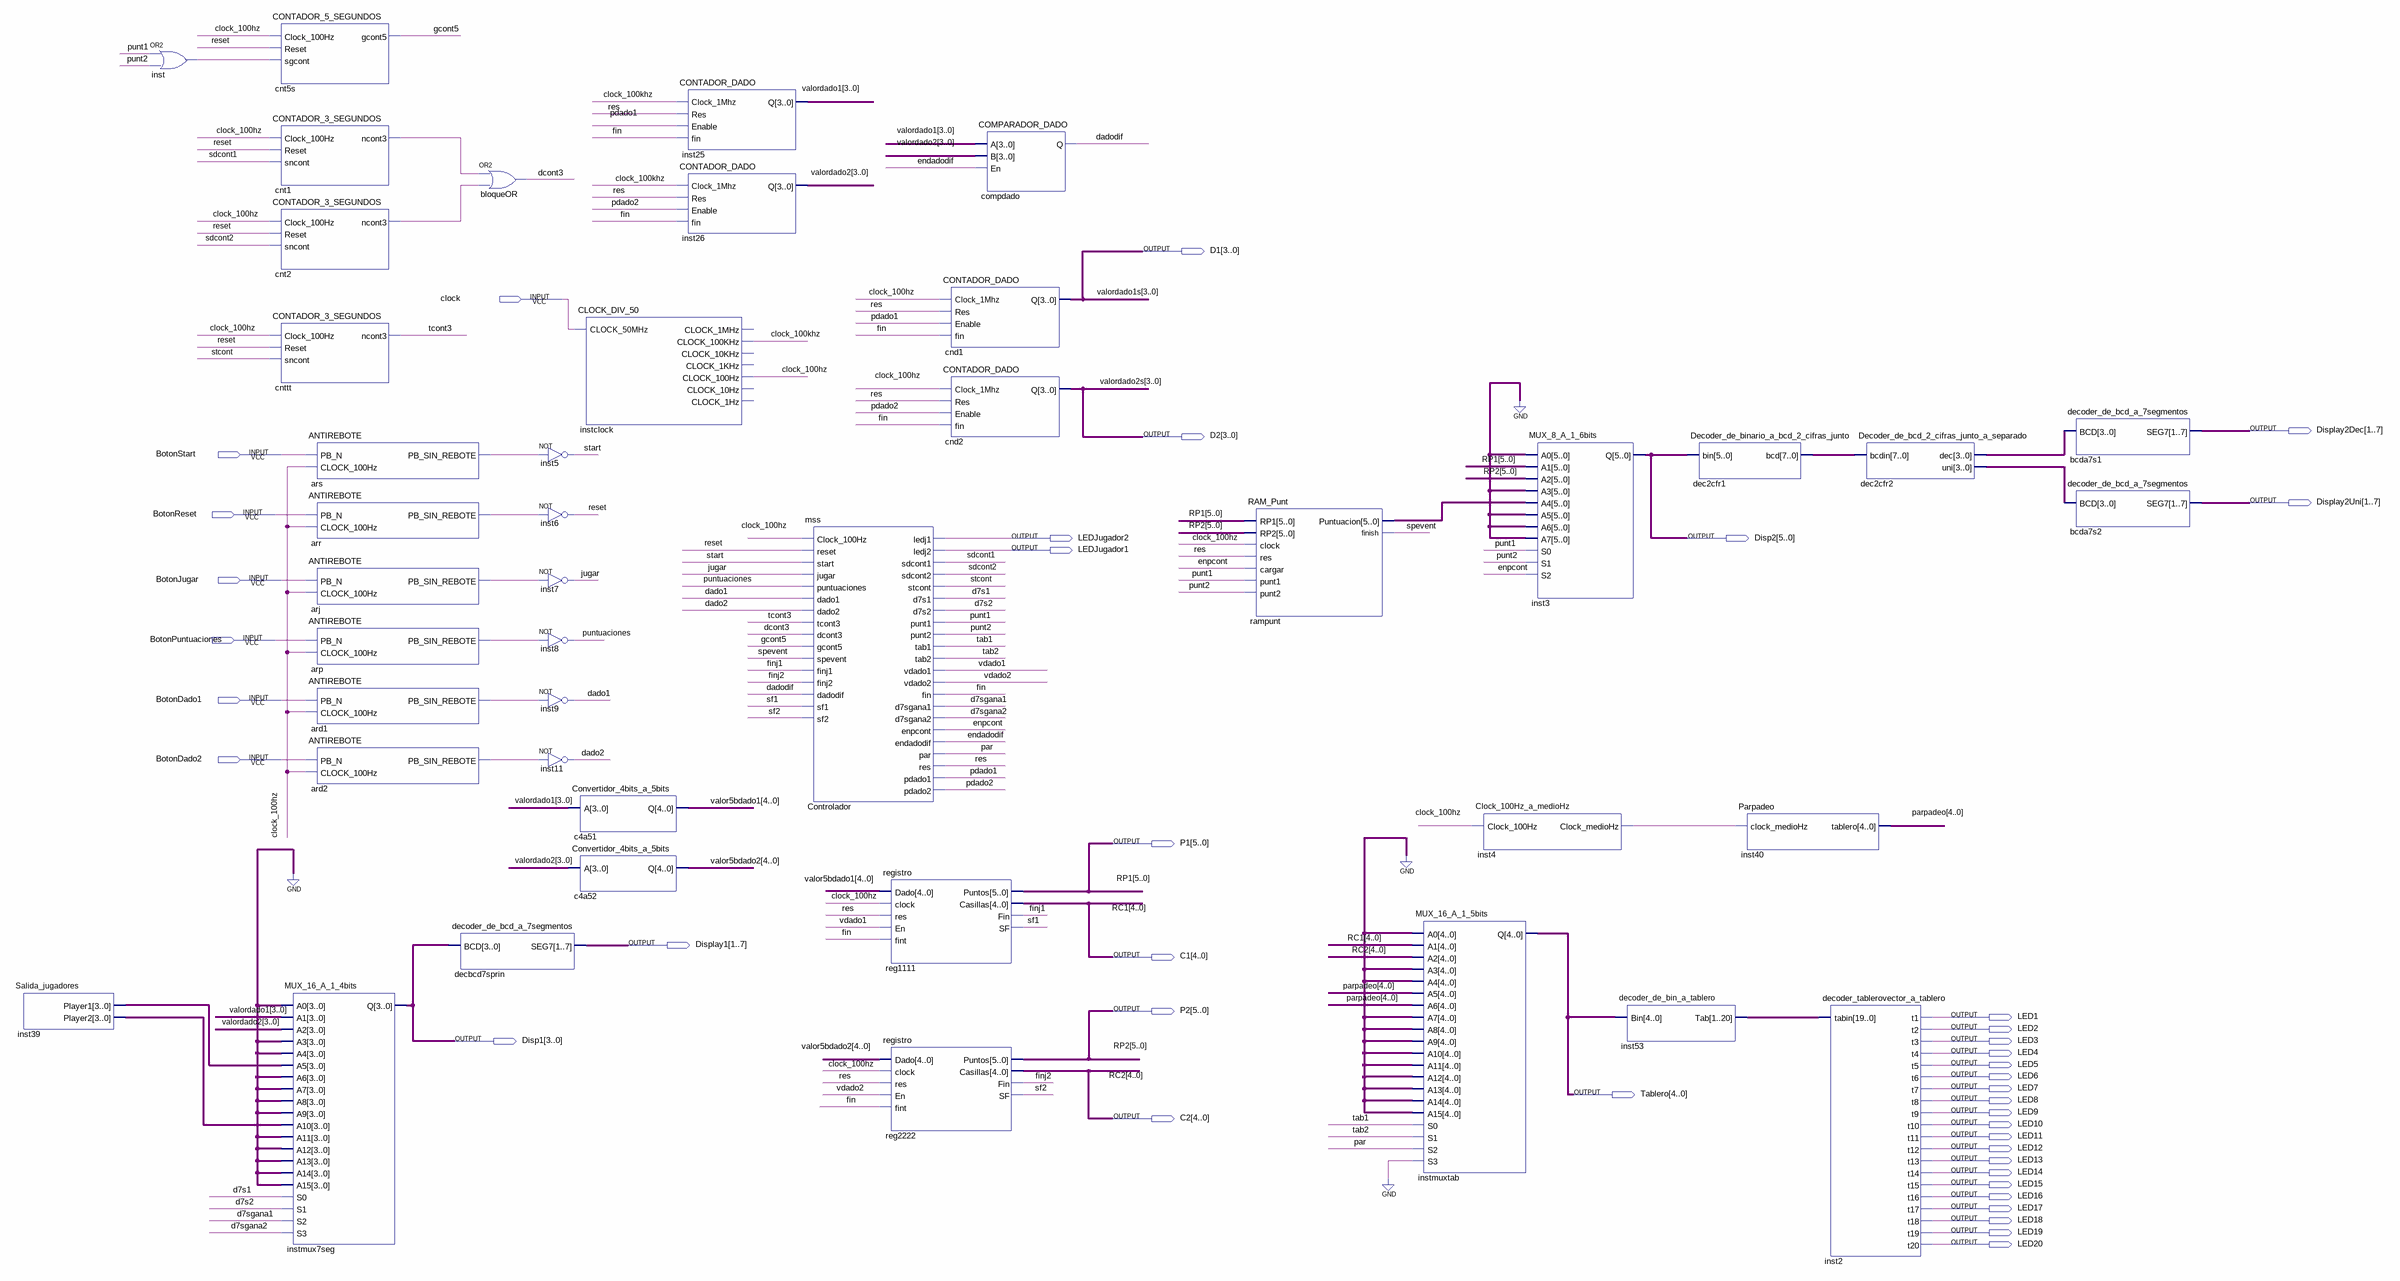
[diagram p0: schematic sheet]
// Quartus schematic ProyectoSD2.bdf as structural Verilog: 43 symbols, 41 pins
module ProyectoSD2 (
  input  clock,
  input  BotonStart,
  input  BotonReset,
  input  BotonJugar,
  input  BotonPuntuaciones,
  input  BotonDado1,
  input  BotonDado2,
  output [3:0] D1,
  output [1:7] Display2Dec,
  output [3:0] D2,
  output [1:7] Display2Uni,
  output LEDJugador2,
  output [5:0] Disp2,
  output LEDJugador1,
  output [5:0] P1,
  output [1:7] Display1,
  output [4:0] C1,
  output [5:0] P2,
  output LED1,
  output LED2,
  output [3:0] Disp1,
  output LED3,
  output LED4,
  output LED5,
  output LED6,
  output LED7,
  output [4:0] Tablero,
  output LED8,
  output LED9,
  output [4:0] C2,
  output LED10,
  output LED11,
  output LED12,
  output LED13,
  output LED14,
  output LED15,
  output LED16,
  output LED17,
  output LED18,
  output LED19,
  output LED20
);

  wire ard1_pb_sin_rebote, ard2_pb_sin_rebote, arj_pb_sin_rebote, arp_pb_sin_rebote, arr_pb_sin_rebote,
       ars_pb_sin_rebote, clock_100hz, clock_100khz, cnt1_ncont3, cnt2_ncont3, d7s1, d7s2, d7sgana1,
       d7sgana2, dado1, dado2, dadodif, dcont3, endadodif, enpcont, fin, finj1, finj2, gcont5,
       inst4_clock_mediohz, inst_out, jugar, par, pdado1, pdado2, punt1, punt2, puntuaciones, res, reset,
       sdcont1, sdcont2, sf1, sf2, spevent, start, stcont, tab1, tab2, tcont3, vdado1, vdado2;
  wire [3:0] dec2cfr2_dec, dec2cfr2_uni, inst39_player1, inst39_player2, valordado1, valordado2;
  wire [4:0] parpadeo, valor5bdado1, valor5bdado2;
  wire [5:0] rampunt_puntuacion;
  wire [7:0] dec2cfr1_bcd;
  wire [19:0] inst53_tab;

  Salida_jugadores inst39 (.Player1(inst39_player1), .Player2(inst39_player2));
  or inst (inst_out, punt1, punt2);
  CONTADOR_5_SEGUNDOS cnt5s (.Clock_100Hz(clock_100hz), .Reset(reset), .sgcont(inst_out), .gcont5(gcont5));
  CONTADOR_3_SEGUNDOS cnt1 (.Clock_100Hz(clock_100hz), .Reset(reset), .sncont(sdcont1), .ncont3(cnt1_ncont3));
  CONTADOR_3_SEGUNDOS cnt2 (.Clock_100Hz(clock_100hz), .Reset(reset), .sncont(sdcont2), .ncont3(cnt2_ncont3));
  CONTADOR_3_SEGUNDOS cnttt (.Clock_100Hz(clock_100hz), .Reset(reset), .sncont(stcont), .ncont3(tcont3));
  ANTIREBOTE ars (.PB_N(BotonStart), .CLOCK_100Hz(clock_100hz), .PB_SIN_REBOTE(ars_pb_sin_rebote));
  ANTIREBOTE arr (.PB_N(BotonReset), .CLOCK_100Hz(clock_100hz), .PB_SIN_REBOTE(arr_pb_sin_rebote));
  ANTIREBOTE arj (.PB_N(BotonJugar), .CLOCK_100Hz(clock_100hz), .PB_SIN_REBOTE(arj_pb_sin_rebote));
  ANTIREBOTE arp (.PB_N(BotonPuntuaciones), .CLOCK_100Hz(clock_100hz), .PB_SIN_REBOTE(arp_pb_sin_rebote));
  ANTIREBOTE ard1 (.PB_N(BotonDado1), .CLOCK_100Hz(clock_100hz), .PB_SIN_REBOTE(ard1_pb_sin_rebote));
  ANTIREBOTE ard2 (.PB_N(BotonDado2), .CLOCK_100Hz(clock_100hz), .PB_SIN_REBOTE(ard2_pb_sin_rebote));
  MUX_16_A_1_4bits instmux7seg (
    .A0(4'b0000), .A1(valordado1), .A2(valordado2), .A3(4'b0000), .A4(4'b0000), .A5(inst39_player1),
    .A6(4'b0000), .A7(4'b0000), .A8(4'b0000), .A9(4'b0000), .A10(inst39_player2), .A11(4'b0000),
    .A12(4'b0000), .A13(4'b0000), .A14(4'b0000), .A15(4'b0000), .S0(d7s1), .S1(d7s2), .S2(d7sgana1),
    .S3(d7sgana2), .Q(Disp1));
  decoder_de_bcd_a_7segmentos decbcd7sprin (.BCD(Disp1), .SEG7(Display1));
  or bloqueOR (dcont3, cnt1_ncont3, cnt2_ncont3);
  not inst5 (start, ars_pb_sin_rebote);
  not inst6 (reset, arr_pb_sin_rebote);
  not inst7 (jugar, arj_pb_sin_rebote);
  not inst8 (puntuaciones, arp_pb_sin_rebote);
  not inst9 (dado1, ard1_pb_sin_rebote);
  not inst11 (dado2, ard2_pb_sin_rebote);
  CLOCK_DIV_50 instclock (
    .CLOCK_50MHz(clock), .CLOCK_100KHz(clock_100khz), .CLOCK_100Hz(clock_100hz));  // open: CLOCK_1MHz, CLOCK_10KHz, CLOCK_1KHz, CLOCK_10Hz, CLOCK_1Hz
  Convertidor_4bits_a_5bits c4a51 (.A(valordado1), .Q(valor5bdado1));
  Convertidor_4bits_a_5bits c4a52 (.A(valordado2), .Q(valor5bdado2));
  CONTADOR_DADO inst25 (.Clock_1Mhz(clock_100khz), .Res(res), .Enable(pdado1), .fin(fin), .Q(valordado1));
  CONTADOR_DADO inst26 (.Clock_1Mhz(clock_100khz), .Res(res), .Enable(pdado2), .fin(fin), .Q(valordado2));
  mss Controlador (
    .Clock_100Hz(clock_100hz), .reset(reset), .start(start), .jugar(jugar), .puntuaciones(puntuaciones),
    .dado1(dado1), .dado2(dado2), .tcont3(tcont3), .dcont3(dcont3), .gcont5(gcont5), .spevent(spevent),
    .finj1(finj1), .finj2(finj2), .dadodif(dadodif), .sf1(sf1), .sf2(sf2), .ledj1(LEDJugador2),
    .ledj2(LEDJugador1), .sdcont1(sdcont1), .sdcont2(sdcont2), .stcont(stcont), .d7s1(d7s1), .d7s2(d7s2),
    .punt1(punt1), .punt2(punt2), .tab1(tab1), .tab2(tab2), .vdado1(vdado1), .vdado2(vdado2), .fin(fin),
    .d7sgana1(d7sgana1), .d7sgana2(d7sgana2), .enpcont(enpcont), .endadodif(endadodif), .par(par), .res(res),
    .pdado1(pdado1), .pdado2(pdado2));
  registro reg1111 (
    .Dado(valor5bdado1), .clock(clock_100hz), .res(res), .En(vdado1), .fint(fin), .Puntos(P1), .Casillas(C1),
    .Fin(finj1), .SF(sf1));
  registro reg2222 (
    .Dado(valor5bdado2), .clock(clock_100hz), .res(res), .En(vdado2), .fint(fin), .Puntos(P2), .Casillas(C2),
    .Fin(finj2), .SF(sf2));
  CONTADOR_DADO cnd1 (.Clock_1Mhz(clock_100hz), .Res(res), .Enable(pdado1), .fin(fin), .Q(D1));
  CONTADOR_DADO cnd2 (.Clock_1Mhz(clock_100hz), .Res(res), .Enable(pdado2), .fin(fin), .Q(D2));
  COMPARADOR_DADO compdado (.A(valordado1), .B(valordado2), .En(endadodif), .Q(dadodif));
  RAM_Punt rampunt (
    .RP1(P1), .RP2(P2), .clock(clock_100hz), .res(res), .cargar(enpcont), .punt1(punt1), .punt2(punt2),
    .Puntuacion(rampunt_puntuacion), .finish(spevent));
  MUX_16_A_1_5bits instmuxtab (
    .A0({5{1'b0}}), .A1(C1), .A2(C2), .A3({5{1'b0}}), .A4({5{1'b0}}), .A5(parpadeo), .A6(parpadeo),
    .A7({5{1'b0}}), .A8({5{1'b0}}), .A9({5{1'b0}}), .A10({5{1'b0}}), .A11({5{1'b0}}), .A12({5{1'b0}}),
    .A13({5{1'b0}}), .A14({5{1'b0}}), .A15({5{1'b0}}), .S0(tab1), .S1(tab2), .S2(par), .S3(1'b0), .Q(Tablero));
  Clock_100Hz_a_medioHz inst4 (.Clock_100Hz(clock_100hz), .Clock_medioHz(inst4_clock_mediohz));
  MUX_8_A_1_6bits inst3 (
    .A0({6{1'b0}}), .A1(P1), .A2(P2), .A3({6{1'b0}}), .A4(rampunt_puntuacion), .A5({6{1'b0}}),
    .A6({6{1'b0}}), .A7({6{1'b0}}), .S0(punt1), .S1(punt2), .S2(enpcont), .Q(Disp2));
  decoder_de_bin_a_tablero inst53 (.Bin(Tablero), .Tab(inst53_tab));
  Decoder_de_binario_a_bcd_2_cifras_junto dec2cfr1 (.bin(Disp2), .bcd(dec2cfr1_bcd));
  Parpadeo inst40 (.clock_medioHz(inst4_clock_mediohz), .tablero(parpadeo));
  decoder_tablerovector_a_tablero inst2 (
    .tabin(inst53_tab), .t1(LED1), .t2(LED2), .t3(LED3), .t4(LED4), .t5(LED5), .t6(LED6), .t7(LED7),
    .t8(LED8), .t9(LED9), .t10(LED10), .t11(LED11), .t12(LED12), .t13(LED13), .t14(LED14), .t15(LED15),
    .t16(LED16), .t17(LED17), .t18(LED18), .t19(LED19), .t20(LED20));
  Decoder_de_bcd_2_cifras_junto_a_separado dec2cfr2 (.bcdin(dec2cfr1_bcd), .dec(dec2cfr2_dec), .uni(dec2cfr2_uni));
  decoder_de_bcd_a_7segmentos bcda7s1 (.BCD(dec2cfr2_dec), .SEG7(Display2Dec));
  decoder_de_bcd_a_7segmentos bcda7s2 (.BCD(dec2cfr2_uni), .SEG7(Display2Uni));

  // Other names for the same wires on the sheet: RC1[4:0] = C1; RC2[4:0] = C2; valordado1s[3:0] = D1;
  //   valordado2s[3:0] = D2; RP1[5:0] = P1; RP2[5:0] = P2
endmodule
